# Altium schematic sheet PW SUPPLY.SchDoc
size OrCAD B; SheetNumber: 2; SheetTotal: 7
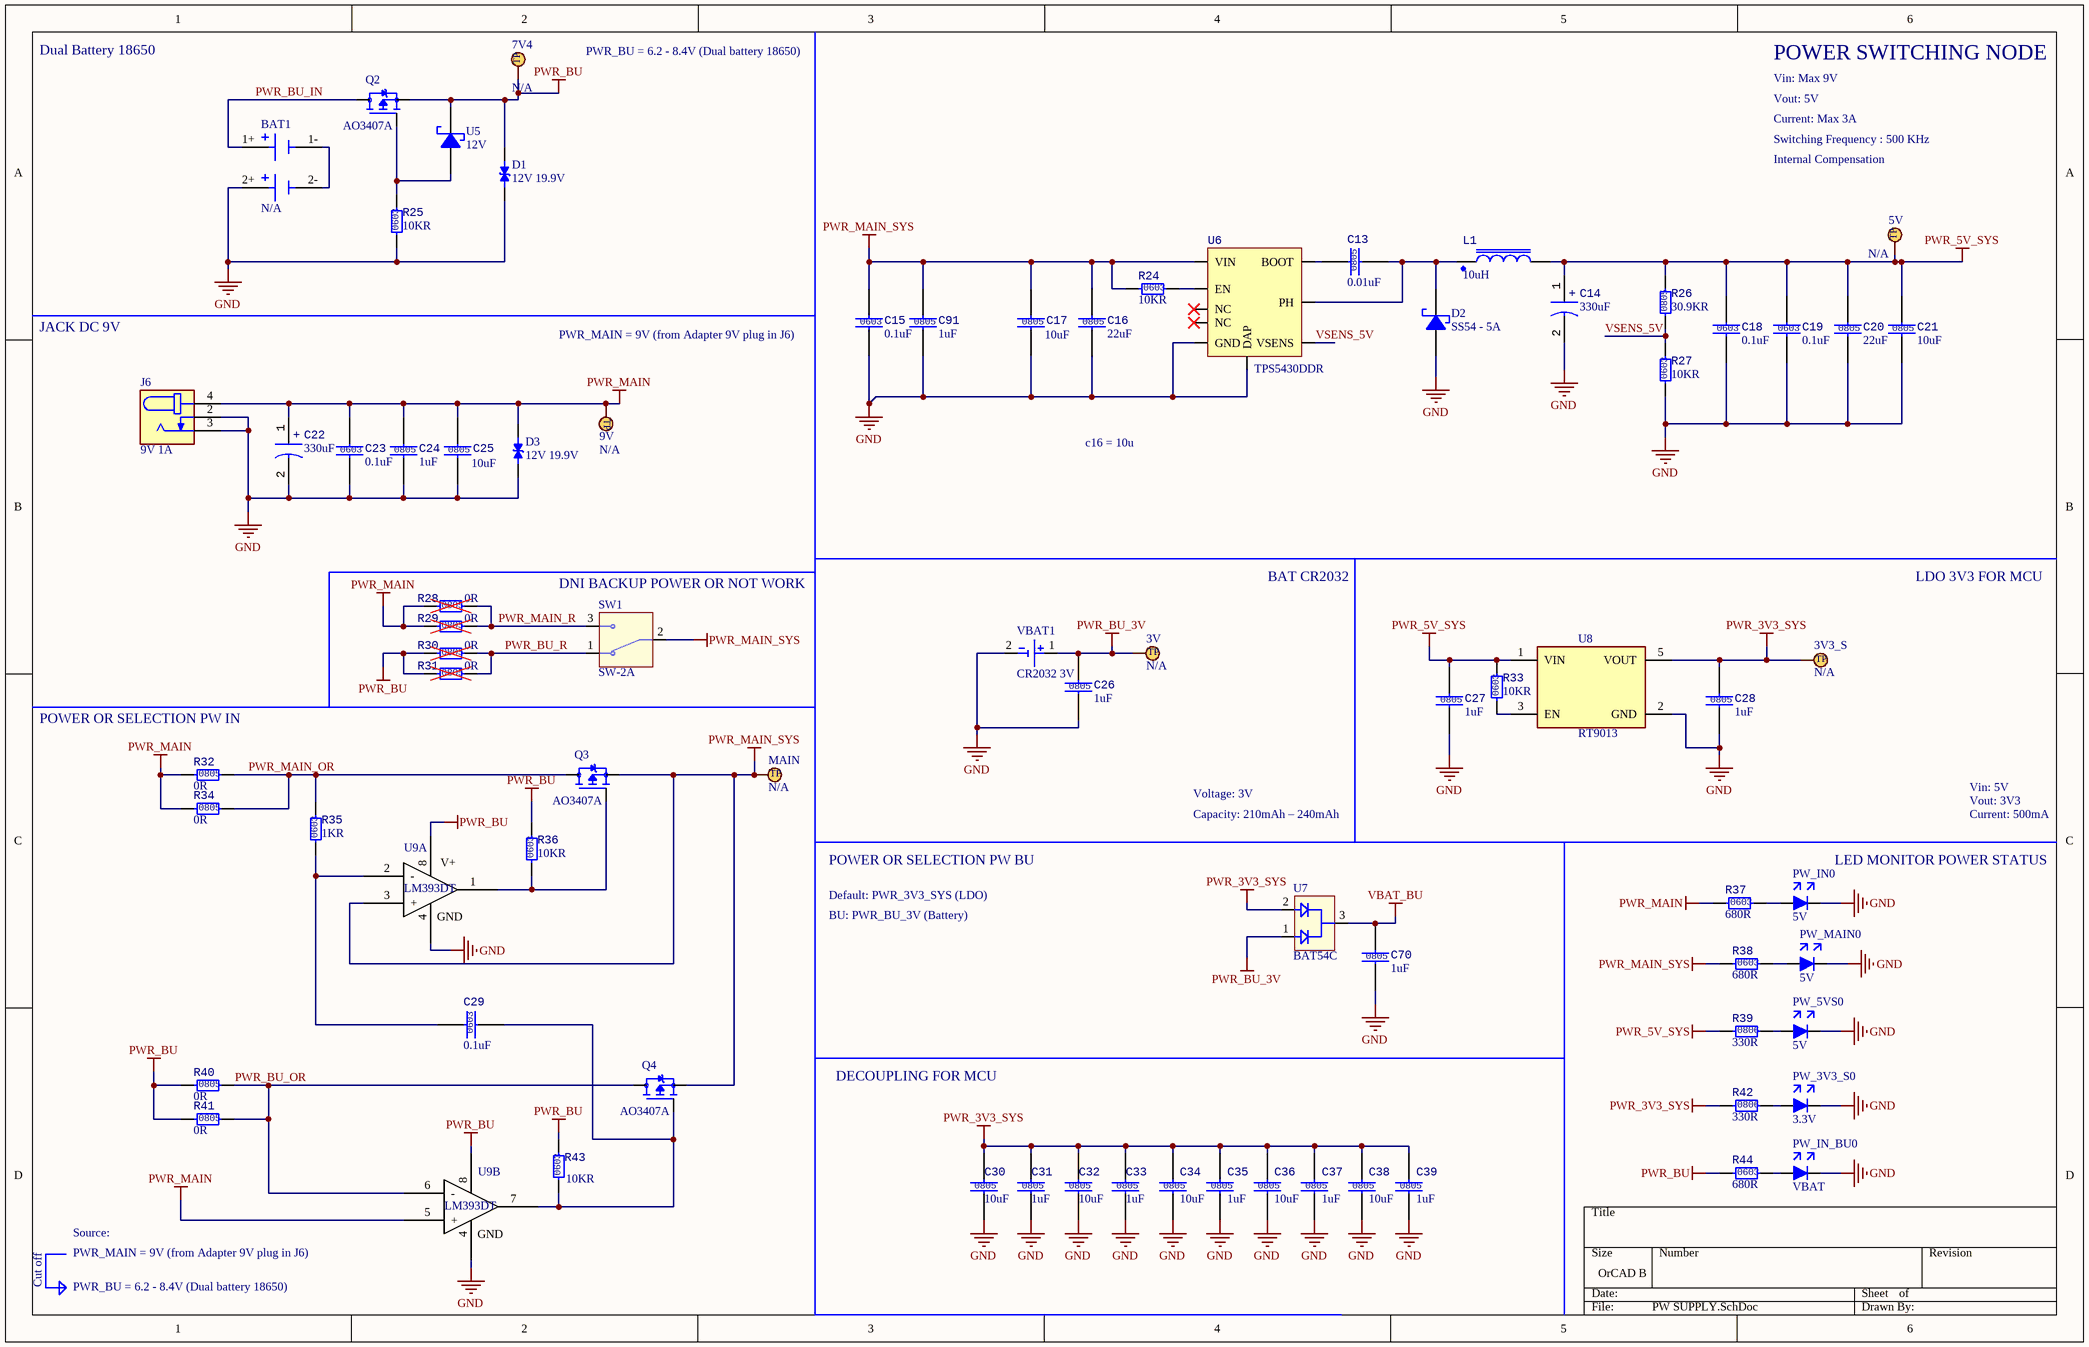
[diagram p0: PW SUPPLY.SchDoc]

## Parts
3V  TEST_POINT  [Test_point]  (value not drawn)
3V3_S  TEST_POINT  [Test_point]  (value not drawn)
5V  TEST_POINT  [Test_point]  (value not drawn)
7V4  TEST_POINT  [Test_point]  (value not drawn)
9V  TEST_POINT  [Test_point]  (value not drawn)
BAT1  Dual_Battery_Case  [Dual_BAT_PCB]  (value not drawn)
C13  Size: 0805  [CAPCER 0805 SMD]  (hidden comment: 0.01uF)
C14  330uF  [CAP ALU 6377]
C15  Size: 0603  [CAPCER 0805 SMD]  (hidden comment: 0.1uF)
C16  Size: 0805  [CAPCER 0805 SMD]  (hidden comment: 22uF)
C17  Size: 0805  [CAPCER 0603 SMD]  (hidden comment: 10uF)
C18  Size: 0603  [CAPCER 0805 SMD]  (hidden comment: 0.1uF)
C19  Size: 0603  [CAPCER 0805 SMD]  (hidden comment: 0.1uF)
C20  Size: 0805  [CAPCER 0805 SMD]  (hidden comment: 22uF)
C21  Size: 0805  [CAPCER 0603 SMD]  (hidden comment: 10uF)
C22  330uF  [CAP ALU 6377]
C23  Size: 0603  [CAPCER 0805 SMD]  (hidden comment: 0.1uF)
C24  Size: 0805  [CAPCER 0805 SMD]  (hidden comment: 1uF)
C25  Size: 0805  [CAPCER 0603 SMD]  (hidden comment: 10uF)
C26  Size: 0805  [CAPCER 0805 SMD]  (hidden comment: 1uF)
C27  Size: 0805  [CAPCER 0805 SMD]  (hidden comment: 1uF)
C28  Size: 0805  [CAPCER 0805 SMD]  (hidden comment: 1uF)
C29  Size: 0603  [CAPCER 0805 SMD]  (hidden comment: 0.1uF)
C30  Size: 0805  [CAPCER 0603 SMD]  (hidden comment: 10uF)
C31  Size: 0805  [CAPCER 0805 SMD]  (hidden comment: 1uF)
C32  Size: 0805  [CAPCER 0603 SMD]  (hidden comment: 10uF)
C33  Size: 0805  [CAPCER 0805 SMD]  (hidden comment: 1uF)
C34  Size: 0805  [CAPCER 0603 SMD]  (hidden comment: 10uF)
C35  Size: 0805  [CAPCER 0805 SMD]  (hidden comment: 1uF)
C36  Size: 0805  [CAPCER 0603 SMD]  (hidden comment: 10uF)
C37  Size: 0805  [CAPCER 0805 SMD]  (hidden comment: 1uF)
C38  Size: 0805  [CAPCER 0603 SMD]  (hidden comment: 10uF)
C39  Size: 0805  [CAPCER 0805 SMD]  (hidden comment: 1uF)
C70  Size: 0805  [CAPCER 0805 SMD]  (hidden comment: 1uF)
C91  Size: 0805  [CAPCER 0805 SMD]  (hidden comment: 1uF)
D1  value 12V 19.9V  [DO-214AC]  (hidden comment: SMAJ12A)
D2  value SS54 - 5A  [DO-214AC]  (hidden comment: SS54)
D3  value 12V 19.9V  [DO-214AC]  (hidden comment: SMAJ12A)
J6  9V 1A  [PW_JACK_DC_5525]
L1  10uH  [IND_8D43]
MAIN  TEST_POINT  [Test_point]  (value not drawn)
PW_3V3_S0  value 3.3V  [LED 0805 SMD]  (hidden comment: LED_RED)
PW_5VS0  value 5V  [LED 0805 SMD]  (hidden comment: LED_RED)
PW_IN0  value 5V  [LED 0805 SMD]  (hidden comment: LED_RED)
PW_IN_BU0  value VBAT  [LED 0805 SMD]  (hidden comment: LED_RED)
PW_MAIN0  value 5V  [LED 0805 SMD]  (hidden comment: LED_RED)
Q2  AO3407A  [SOT23-3]
Q3  AO3407A  [SOT23-3]
Q4  AO3407A  [SOT23-3]
R24  Size: 0603  [RESC 0603(1608) SMD]  (hidden comment: 10KR)
R25  Size: 0603  [RESC 0603(1608) SMD]  (hidden comment: 10KR)
R26  Size: 0805  [RESC 0805 SMD]  (hidden comment: 30.9KR)
R27  Size: 0603  [RESC 0603(1608) SMD]  (hidden comment: 10KR)
R28  Size: 0805  [RESC 0805 SMD]  (hidden comment: 0R)
R29  Size: 0805  [RESC 0805 SMD]  (hidden comment: 0R)
R30  Size: 0805  [RESC 0805 SMD]  (hidden comment: 0R)
R31  Size: 0805  [RESC 0805 SMD]  (hidden comment: 0R)
R32  Size: 0805  [RESC 0805 SMD]  (hidden comment: 0R)
R33  Size: 0603  [RESC 0603(1608) SMD]  (hidden comment: 10KR)
R34  Size: 0805  [RESC 0805 SMD]  (hidden comment: 0R)
R35  Size: 0603  [RESC 0603(1608) SMD]  (hidden comment: 1KR)
R36  Size: 0603  [RESC 0603(1608) SMD]  (hidden comment: 10KR)
R37  Size: 0603  [RESC 0603(1608) SMD]  (hidden comment: 680R)
R38  Size: 0603  [RESC 0603(1608) SMD]  (hidden comment: 680R)
R39  Size: 0806  [RESC 0805 SMD]  (hidden comment: 330R)
R40  Size: 0805  [RESC 0805 SMD]  (hidden comment: 0R)
R41  Size: 0805  [RESC 0805 SMD]  (hidden comment: 0R)
R42  Size: 0806  [RESC 0805 SMD]  (hidden comment: 330R)
R43  Size: 0603  [RESC 0603(1608) SMD]  (hidden comment: 10KR)
R44  Size: 0603  [RESC 0603(1608) SMD]  (hidden comment: 680R)
SW1  value SW-2A  [SLIDE-SW]  (hidden comment: SW 2A)
U5  value 12V  [SOD-123F]  (hidden comment: BZT52H)
U6  value TPS5430DDR  [8-SOIC]  (hidden comment: TPS5430DDAR)
U7  BAT54C  [SOT23-3]
U8  RT9013  [SOT-23-5]
U9  LM393DT  [8-SOIC-OPA]  (parts A,B of 2)
VBAT1  value CR2032 3V  [HOLDER BAT]  (hidden comment: HOL CR2032)

## Nets
GND: BAT1.2+ C14.2 C15.2 C16.2 C17.2 C18.2 C19.2 C20.2 C21.2 C22.2 C23.2 C24.2 C25.2 C26.2 C27.2 C28.2 C30.2 C31.2 C32.2 C33.2 C34.2 C35.2 C36.2 C37.2 C38.2 C39.2 C70.2 C91.2 D1.1 D2.1(A) D3.1 J6.2 J6.3 PW_3V3_S0.C(K) PW_5VS0.C(K) PW_IN0.C(K) PW_IN_BU0.C(K) PW_MAIN0.C(K) R25.1 R27.1 U6.6(GND) U6.9(DAP) U8.2(GND) U9.4(GND) VBAT1.2(NEG)
PWR_3V3_SYS: 3V3_S.1 C28.1 C30.1 C31.1 C32.1 C33.1 C34.1 C35.1 C36.1 C37.1 C38.1 C39.1 R42.1 U7.2 U8.5(VOUT)
PWR_5V_SYS: 5V.1 C14.1 C18.1 C19.1 C20.1 C21.1 C27.1 L1.2 R26.2 R33.2 R39.1 U8.1(VIN)
PWR_BU: 7V4.1 D1.2 Q2.2(S) R30.1 R31.1 R36.2 R40.1 R41.1 R43.2 R44.1 U5.2(K) U9.8(VCC)
PWR_BU_3V: 3V.1 C26.1 U7.1 VBAT1.1(POS)
PWR_MAIN: 9V.1 C22.1 C23.1 C24.1 C25.1 D3.2 J6.4 R28.1 R29.1 R32.1 R34.1 R37.1 U9.5(+)
PWR_MAIN_SYS: C15.1 C16.1 C17.1 C91.1 MAIN.1 Q3.2(S) Q4.2(S) R24.1 R38.1 SW1.2 U6.7(VIN) U9.3(+)
VBAT_BU: C70.1 U7.3
PWR_BU_IN: BAT1.1+ Q2.3(D)
PWR_BU_OR: Q4.3(D) R40.2 R41.2 U9.6(-)
PWR_BU_R: R30.2 R31.2 SW1.1
PWR_MAIN_OR: Q3.3(D) R32.2 R34.2 R35.2
PWR_MAIN_R: R28.2 R29.2 SW1.3
VSENS_5V: R26.1 R27.2 U6.4(VSENS)
NetBAT1_1-: BAT1.1- BAT1.2-
NetC13_1: C13.1 U6.1(BOOT)
NetC13_2: C13.2 D2.2(K) L1.1 U6.8(PH)
NetC29_1: C29.1 R35.1 U9.2(-)
NetC29_2: C29.2 Q4.1(G) R43.1 U9.7(OUT_2)
NetPW_3V3_S0_A: PW_3V3_S0.A R42.2
NetPW_5VS0_A: PW_5VS0.A R39.2
NetPW_IN0_A: PW_IN0.A R37.2
NetPW_IN_BU0_A: PW_IN_BU0.A R44.2
NetPW_MAIN0_A: PW_MAIN0.A R38.2
NetQ2_1: Q2.1(G) R25.2 U5.1(A)
NetQ3_1: Q3.1(G) R36.1 U9.1(OUT_1)
NetR24_2: R24.2 U6.5(EN)
NetR33_1: R33.1 U8.3(EN)

Not connected (* = marked no-connect by the designer): U6 2(NC)* 3(NC)*

## Notes on the sheet
- Dual Battery 18650
- PWR_BU = 6.2 - 8.4V (Dual battery 18650)
- POWER SWITCHING NODE
- Vin: Max 9V
- Vout: 5V
- Current: Max 3A
- Switching Frequency : 500 KHz
- Internal Compensation
- JACK DC 9V
- PWR_MAIN = 9V (from Adapter 9V plug in J6)
- c16 = 10u
- (near SW1) DNI BACKUP POWER OR NOT WORK
- BAT CR2032
- LDO 3V3 FOR MCU
- (near R32) POWER OR SELECTION PW IN
- Voltage: 3V
- Capacity: 210mAh – 240mAh
- Vin: 5V
- Vout: 3V3
- Current: 500mA
- POWER OR SELECTION PW BU
- (near PW_IN0) LED MONITOR POWER STATUS
- Default: PWR_3V3_SYS (LDO)
- BU: PWR_BU_3V (Battery)
- DECOUPLING FOR MCU
- Source:
- Cut off
- (in symbol DB-0010, part A) V+
- (in symbol DB-0034) TP
- (in symbol DB-0044) +

## Library data of the parts
3V 3V3_S 5V 7V4 9V MAIN = DB-0034: Value: N/A; Design Item ID: DB-0034; Power Rate: N/A; Tolerance: N/A; Footprint Type: PAD; Size: PAD
BAT1 = DB-0031: Dual_Battery_Case_18650; Value: N/A; Footprint Path: .\Database_Library\Library.PcbLib; Design Item ID: DB-0031; Type: Case; Power Rate: N/A; Tolerance: N/A; Footprint Type: TFT; Supplier Link: https://www.thegioiic.com/de-pin-2x18650-han-pcb
C13 = DB-0010: CAPACITOR SMD 0.01uF 50V 10% 0805; Value: 0.01uF; Footprint Path: .\Database_Library\Library.PcbLib; Design Item ID: DB-0010; Type: CAPACITOR; Power Rate: N/A; Tolerance: 10%; Footprint Type: SMD; Supplier: THEGIOIIC; Supplier Part Number: Tụ Gốm 0805 410nF 50V; Supplier Link: https://www.thegioiic.com/tu-gom-0805-10nf-50v
C14 C22 = DB-0044: CAPACITOR ALU SMD 220uF 6.3V 20% 6377; Value: 330uF; Design Item ID: DB-0044; Type: CAPACITOR ALU; Power Rate: N/A; Tolerance: 20%; Footprint Type: SMD; Size: 6377; Supplier: THEGIOIIC; Supplier Part Number: Tụ Nhôm SMD 330uF 6.3V 6.3x7.7mm; Supplier Link: https://www.thegioiic.com/tu-nhom-smd-330uf-6-3v-6-3x7-7mm
C15 C18 C19 C23 C29 = DB-0017: CAPACITOR SMD 0.1uF 50V 10% 0603; Value: 0.1uF; Design Item ID: DB-0017; Type: CAPACITOR; Power Rate: N/A; Tolerance: 10%; Footprint Type: SMD; Supplier: THEGIOIIC; Supplier Part Number: Tụ Gốm 0603 100nF (0.1uF) 25V; Supplier Link: https://www.thegioiic.com/tu-gom-0603-100nf-0-1uf-25v
  C15 C18 C19 C23: Footprint Path: .\Database_Library\Library.PcbLib
C16 C20 = DB-0056: CAPACITOR SMD 22uF 50V 10% 0805; Design Item ID: DB-0056; Value: 22uF; Type: CAPACITOR; Power Rate: N/A; Tolerance: 10%; Footprint Type: SMD; Supplier: THEGIOIIC; Supplier Part Number: Tụ Gốm 0805 22uF 6.3V; Supplier Link: https://www.thegioiic.com/tu-gom-0805-22uf-6-3v
C17 C21 C25 C30 C32 C34 C36 C38 = DB-0018: CAPACITOR SMD 10uF 25V 10% 0805; Value: 10uF; Design Item ID: DB-0018; Type: CAPACITOR; Power Rate: N/A; Tolerance: 10%; Footprint Type: SMD; Supplier: THEGIOIIC; Supplier Part Number: Tụ Gốm 0805 10uF 25V; Supplier Link: https://www.thegioiic.com/tu-gom-0805-10uf-25v
  C17 C25: Footprint Path: .\Database_Library\Library.PcbLib
C24 C26-C28 C31 C33 C35 C37 C39 C70 C91 = DB-0063: CAPACITOR SMD 1uF 16V 10% 0805; Design Item ID: DB-0063; Value: 1uF; Type: CAPACITOR; Power Rate: N/A; Tolerance: 10%; Footprint Type: SMD; Supplier: THEGIOIIC; Supplier Part Number: Tụ Gốm 0805 1uF 16V; Supplier Link: https://www.thegioiic.com/tu-gom-0805-1uf-16v
D1 D3 = DB-0078: TVS DIODE 12V 19.9V DO214AC; Design Item ID: DB-0078; Type: DIODE; Power Rate: N/A; Tolerance: N/A; Footprint Type: SMD; Size: SMA; Supplier: DIGIKEY; Supplier Part Number: TVS DIODE 5VWM 9.2VC SMA; Supplier Link: https://www.digikey.com/en/products/detail/diodes-incorporated/smaj5-0a-13/278666
D2 = DB-0029: Design Item ID: DB-0029; Footprint Type: SMD
J6 = DB-0009: Design Item ID: DB-0009; Value: 9V 1A; Footprint Type: THT; Size: 5525
L1 = Cuộn Cảm Dán SMD 8D43-100 10uH 5.5A: Value: 10uH; Design Item ID: DB-0011; Footprint Type: SMD; Size: IND_8D43; Supplier: THEGIOIIC; Supplier Link: https://www.thegioiic.com/cuon-cam-dan-smd-8d43-100-10uh-5-5a
PW_3V3_S0 PW_5VS0 PW_IN0 PW_IN_BU0 PW_MAIN0 = DB-0020: Size 2x1.2mm, điện áp 1.8-2.6VDC; Design Item ID: DB-0020; Type: LED; Power Rate: N/A; Tolerance: N/A; Footprint Type: SMD; Size: 0806; Supplier: THEGIOIIC; Supplier Part Number: LED Đỏ 0805 Dán SMD Trong Suốt Harvatek; Supplier Link: https://www.thegioiic.com/led-do-0805-dan-smd-trong-suot-harvatek
Q2-Q4 = DB-0041: AO3407A MOSFET Kênh P 30V 4.3A SOT-23-3; Type: P_MOSFET; Value: AO3407A; Design Item ID: DB-0041; Power Rate: N/A; Tolerance: N/A; Footprint Type: SMD; Size: SOT23-3; Supplier: THEGIOIIC; Supplier Part Number: AO3407A MOSFET Kênh P 30V 4.3A SOT-23-3; Supplier Link: https://www.thegioiic.com/ao3407a-mosfet-kenh-p-30v-4-3a-sot-23-3
R24 R25 R27 R33 R36 R43 = DB-0003: RESISTOR SMD 10KR OHM 1% 100mW 0603; Power Rate: 100mW; Value: 10KR; Design Item ID: DB-0003; Type: RESISTOR; Tolerance: 1%; Footprint Type: SMD; Supplier: THEGIOIIC; Supplier Part Number: Điện Trở 10 KOhm 0603 1%; Supplier Link: https://www.thegioiic.com/dien-tro-10-kohm-0603-1-
  R24 R27: Footprint Path: .\Database_Library\Library.PcbLib
R26 = DB-0012: Điện Trở 30.9 KOhm 0805 1%; Power Rate: *; Design Item ID: DB-0012; Value: 30.9KR; Type: RESISTOR; Footprint Type: SMD; Supplier: THEGIOIIC; Supplier Link: https://www.thegioiic.com/dien-tro-30-9-kohm-0805-1-
R28-R32 R34 R40 R41 = DB-0015: Power Rate: *; Design Item ID: DB-0015; Value: 0R; Type: RESISTOR; Footprint Type: SMD; Supplier: THEGIOIIC; Supplier Link: https://www.thegioiic.com/san-pham/dien-tro-dan-smd?prid=21990
R35 = DB-0081: RESISTOR SMD 1KR OHM 1% 100mW 0603; Power Rate: 100mW; Design Item ID: DB-0081; Value: 1KR; Type: RESISTOR; Tolerance: 1%; Footprint Type: SMD; Supplier: THEGIOIIC; Supplier Part Number: Điện Trở 1 KOhm 0603 1%; Supplier Link: https://www.thegioiic.com/dien-tro-1-kohm-0603-1-
R37 R38 R44 = DB-0001: RESISTOR SMD 680R OHM 5% 100mW 0603; Power Rate: 100mW; Value: 680R; Design Item ID: DB-0001; Type: RESISTOR; Tolerance: 5%; Footprint Type: SMD; Supplier: THEGIOIIC; Supplier Part Number: Điện Trở 680 Ohm 0603 5%; Supplier Link: https://www.thegioiic.com/dien-tro-680-ohm-0603-5-
R39 R42 = DB-0048: RESISTOR SMD 330R OHM 1% 125mW 0805; Power Rate: 125mW; Value: 330R; Design Item ID: DB-0048; Type: RESISTOR; Tolerance: 1%; Footprint Type: SMD; Supplier: THEGIOIIC; Supplier Part Number: Điện Trở 330 Ohm 0805 1%; Supplier Link: https://www.thegioiic.com/dien-tro-330-ohm-0805-1-
SW1 = DB-0083: SS-12F23G4 Công Tắc Trượt 5 Chân Xuyên Lỗ ON-OFF Chỉnh Ngang 1P2T 2A; Design Item ID: DB-0083; Type: SLIDE SWITCH; Power Rate: 2A; Tolerance: N/A; Footprint Type: TFT; Size: SW-TH; Supplier: THEGIOIIC; Supplier Part Number: SS-12F23G4 Công Tắc Trượt 5 Chân Xuyên Lỗ ON-OFF Chỉnh Ngang 1P2T 2A; Supplier Link: https://www.thegioiic.com/ss-12f23g4-cong-tac-truot-5-chan-xuyen-lo-on-off-chinh-ngang-1p2t-2a
U5 = DB-0042: BZT52H-C12 Diode Zener 12V 375mW SOD-123F; Tolerance: 5%; Design Item ID: DB-0042; Type: DIODE_ZE; Power Rate: 375mW; Footprint Type: SMD; Size: SOD-123F; Supplier: THEGIOIIC; Supplier Part Number: BZT52H-C12 Diode Zener 12V 375mW SOD-123F; Supplier Link: https://www.thegioiic.com/bzt52c5v1-diode-zener-5-1v-500mw
U6 = DB-0002: TPS543x 3A, Wide Input Range, Step-Down Converter; Footprint Path: .\Database_Library\Library.PcbLib; Design Item ID: DB-0002; Type: IC; Power Rate: N/A; Tolerance: N/A; Footprint Type: SMD; Size: 8-SOIC; Supplier: THEGIOIIC; Supplier Part Number: TPS5430DDAR IC Điều Chỉnh Giảm Áp 3A 8-SOIC; Supplier Link: https://www.thegioiic.com/tps5430ddar-ic-dieu-chinh-giam-ap-3a-8-soic
U7 = DB-0013: DIODE ARRAY SCHOTTKY 30V SOT23-3; Design Item ID: DB-0013; Value: BAT54C; Type: DIODE SCHOTTKY; Footprint Type: SMD; Size: SOT23; Supplier: THEGIOIIC; Supplier Link: https://www.thegioiic.com/bat54c
U8 = DB-0062: IC REG LINEAR 3.3V 500MA SOT23-5; Value: RT9013; Design Item ID: DB-0062; Type: IC; Power Rate: N/A; Tolerance: N/A; Footprint Type: SMD; Size: SOT-23-5; Supplier: THEGIOIIC; Supplier Part Number: RT9013-33GB IC Ổn Áp 3.3V 500mA SOT-23-5; Supplier Link: https://www.thegioiic.com/rt9013-33gb-ic-on-ap-3-3v-500ma-sot-23-5
U9 = DB-0010: Design Item ID: DB-0010; Value: LM393DT; Footprint Type: SMD; Size: 8-SOIC; Supplier: THEGIOIIC
VBAT1 = DB-0072: BS-6 Đế Pin CR2032 CR2025 Dán SMD; Design Item ID: DB-0072; Type: HOLDER BAT; Power Rate: N/A; Tolerance: N/A; Footprint Type: SMD; Size: SMD; Supplier: THEGIOIIC; Supplier Part Number: BS-6 Đế Pin CR2032 CR2025 Dán SMD; Supplier Link: https://www.thegioiic.com/bs-6-de-pin-cr2032-cr2025-dan-smd